# EAGLE schematic Teensy_Stromzaehler (EAGLE 9.6.0)
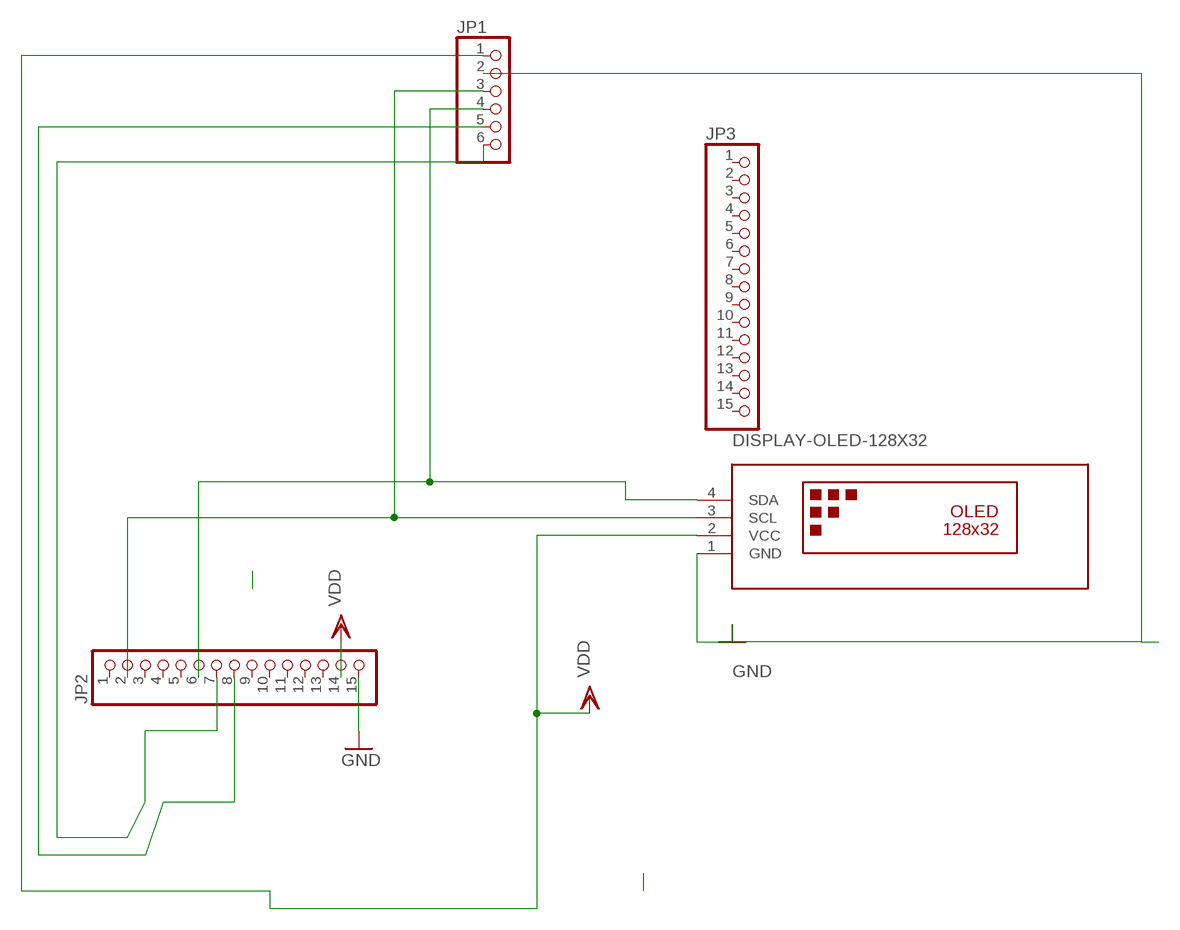
[diagram p0: schematic, sheet 1]

## Parts
JP1  PINHD-1X6  [1X06]
JP2  PINHD-1X15  [1X15]
JP3  PINHD-1X15  [1X15]
U$3  DISPLAY-OLED-128X32  [DISPLAY-OLED-128X32]

## Nets
GND: JP1.2 JP2.15 U$3.1(GND)
N$5: JP1.5 JP2.8
N$6: JP1.6 JP2.7
N$14: JP1.3 JP2.2 U$3.3(SCL)
N$15: JP1.4 JP2.6 U$3.4(SDA)
VDD: JP1.1 JP2.14 U$3.2(VCC)
Unconnected: JP2.1 JP2.3 JP2.4 JP2.5 JP2.9 JP2.10 JP2.11 JP2.12 JP2.13 JP3.1 JP3.2 JP3.3 JP3.4 JP3.5 JP3.6 JP3.7 JP3.8 JP3.9 JP3.10 JP3.11 JP3.12 JP3.13 JP3.14 JP3.15

## Library data of the parts
JP1 = pinhead:PINHD-1X6: PIN HEADER
JP2 JP3 = pinhead:PINHD-1X15: PIN HEADER
U$3 = diy-modules:DISPLAY-OLED-128X32: 128x32 Dot Matrix OLED Module with I2C interface based on SSD1306 chip More details available here: http://www.tinyosshop.com/index.php?route=product/product&product_id=953 Schematic available here: http://www.tinyosshop.com/datasheet/OLED%2012832.pdf SSD1306 datasheet: https://cdn-shop.adafruit.com/datasheets/SSD1306.pdf Click here to find device on ebay.com <http://www.ebay.com/sch/oled+display+128x32+i2c>